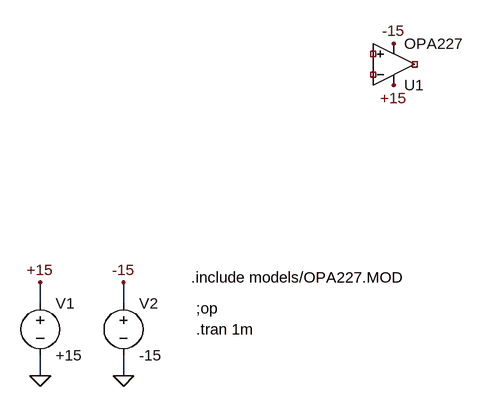
[diagram p0: schematic opa277_template.asc]
opa277_template.asc, the LTspice schematic file:
Version 4
SHEET 1 880 680
WIRE -688 224 -688 192
WIRE -560 224 -560 192
WIRE -688 336 -688 304
WIRE -560 336 -560 304
FLAG -688 336 0
FLAG -560 336 0
FLAG -688 192 +15
FLAG -560 192 -15
FLAG -144 -112 +15
FLAG -144 -176 -15
SYMBOL voltage -688 208 R0
WINDOW 123 0 0 Left 0
WINDOW 39 0 0 Left 0
SYMATTR InstName V1
SYMATTR Value +15
SYMBOL voltage -560 208 R0
WINDOW 123 0 0 Left 0
WINDOW 39 0 0 Left 0
SYMATTR InstName V2
SYMATTR Value -15
SYMBOL Opamps\\opamp2 -144 -80 M180
SYMATTR InstName U1
SYMATTR Value OPA227
TEXT -456 184 Left 0 !.include models/OPA227.MOD
TEXT -448 232 Left 0 !;op
TEXT -448 264 Left 0 !.tran 1m

The netlist it stands for:
* opa277_template.asc
V1 +15 0 +15
V2 -15 0 -15
XU1 NC_01 NC_02 +15 -15 NC_03 OPA227  ; pins In+ In- V+ V- OUT
.include models/OPA227.MOD
;op
.tran 1m
.backanno
.end